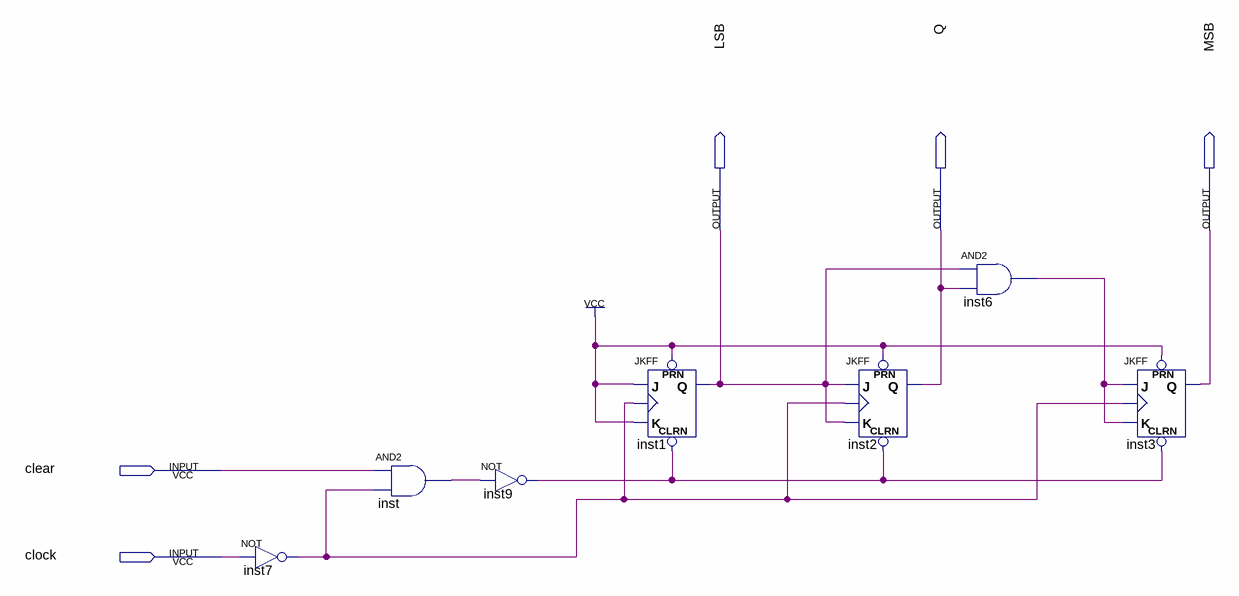
[diagram p0: schematic sheet]
// Quartus schematic contador_sincrono_box.bdf as structural Verilog: 7 symbols, 5 pins
module contador_sincrono_box (
  input  clear,
  input  clock,
  output LSB,
  output Q,
  output MSB
);

  wire inst6_out, inst7_out, inst9_out, inst_out;

  not inst7 (inst7_out, clock);
  and inst (inst_out, clear, inst7_out);
  not inst9 (inst9_out, inst_out);
  JKFF inst1 (.PRN(1'b1), .CLRN(inst9_out), .K(1'b1), .J(1'b1), .CLK(inst7_out), .Q(LSB));
  JKFF inst2 (.PRN(1'b1), .CLRN(inst9_out), .K(LSB), .J(LSB), .CLK(inst7_out), .Q(Q));
  and inst6 (inst6_out, LSB, Q);
  JKFF inst3 (.PRN(1'b1), .CLRN(inst9_out), .K(inst6_out), .J(inst6_out), .CLK(inst7_out), .Q(MSB));
endmodule
